# EAGLE design 24V_PWS (EAGLE 9.6.2)
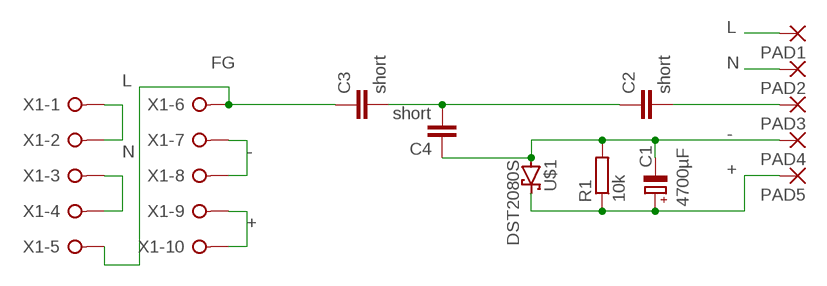
[diagram p0: schematic, sheet 1]

## Parts
C1  4700µF  CPOL-EUE7.5-18  [E7,5-18]
C2  short  C-EUC1206  [C1206]
C3  short  C-EUC1206  [C1206]
C4  short  C-EUC1206  [C1206]
PAD1  SMD5  [SMD2,54-5,08]
PAD2  SMD5  [SMD2,54-5,08]
PAD3  SMD5  [SMD2,54-5,08]
PAD4  SMD5  [SMD2,54-5,08]
PAD5  SMD5  [SMD2,54-5,08]
R1  10k  R-EU_R2012  [R2012]
U$1  DST2080S  [TO-277B]
X1  W237-10P  [W237-10P]

## Nets
+: C1.+ PAD5.1(P) R1.1 U$1.P$1(C) X1.9 X1.10
-: C1.- C4.1 PAD4.1(P) R1.2 U$1.P$2(A) U$1.P$3(A) X1.7 X1.8
FG: C3.1 X1.5 X1.6
L: PAD1.1(P) X1.1 X1.2
N: PAD2.1(P) X1.3 X1.4
N$1: C2.2 PAD3.1(P)
N$2: C2.1 C3.2 C4.2

## Library data of the parts
C1 = rcl:CPOL-EU: POLARIZED CAPACITOR, European symbol; SPICEPREFIX: C
C2-C4 = rcl:C-EU: CAPACITOR, European symbol; SPICEPREFIX: C
PAD1-PAD5 = wirepad:SMD5: SMD PAD
R1 = rcl:R-EU_: RESISTOR, European symbol; SPICEPREFIX: R
U$1 = Orzada:DST2080S: Schottky Diode TO-277B
X1 = con-wago-508:W237-10P: WAGO SREW CLAMP; OC_FARNELL: unknown; OC_NEWARK: unknown

## Board
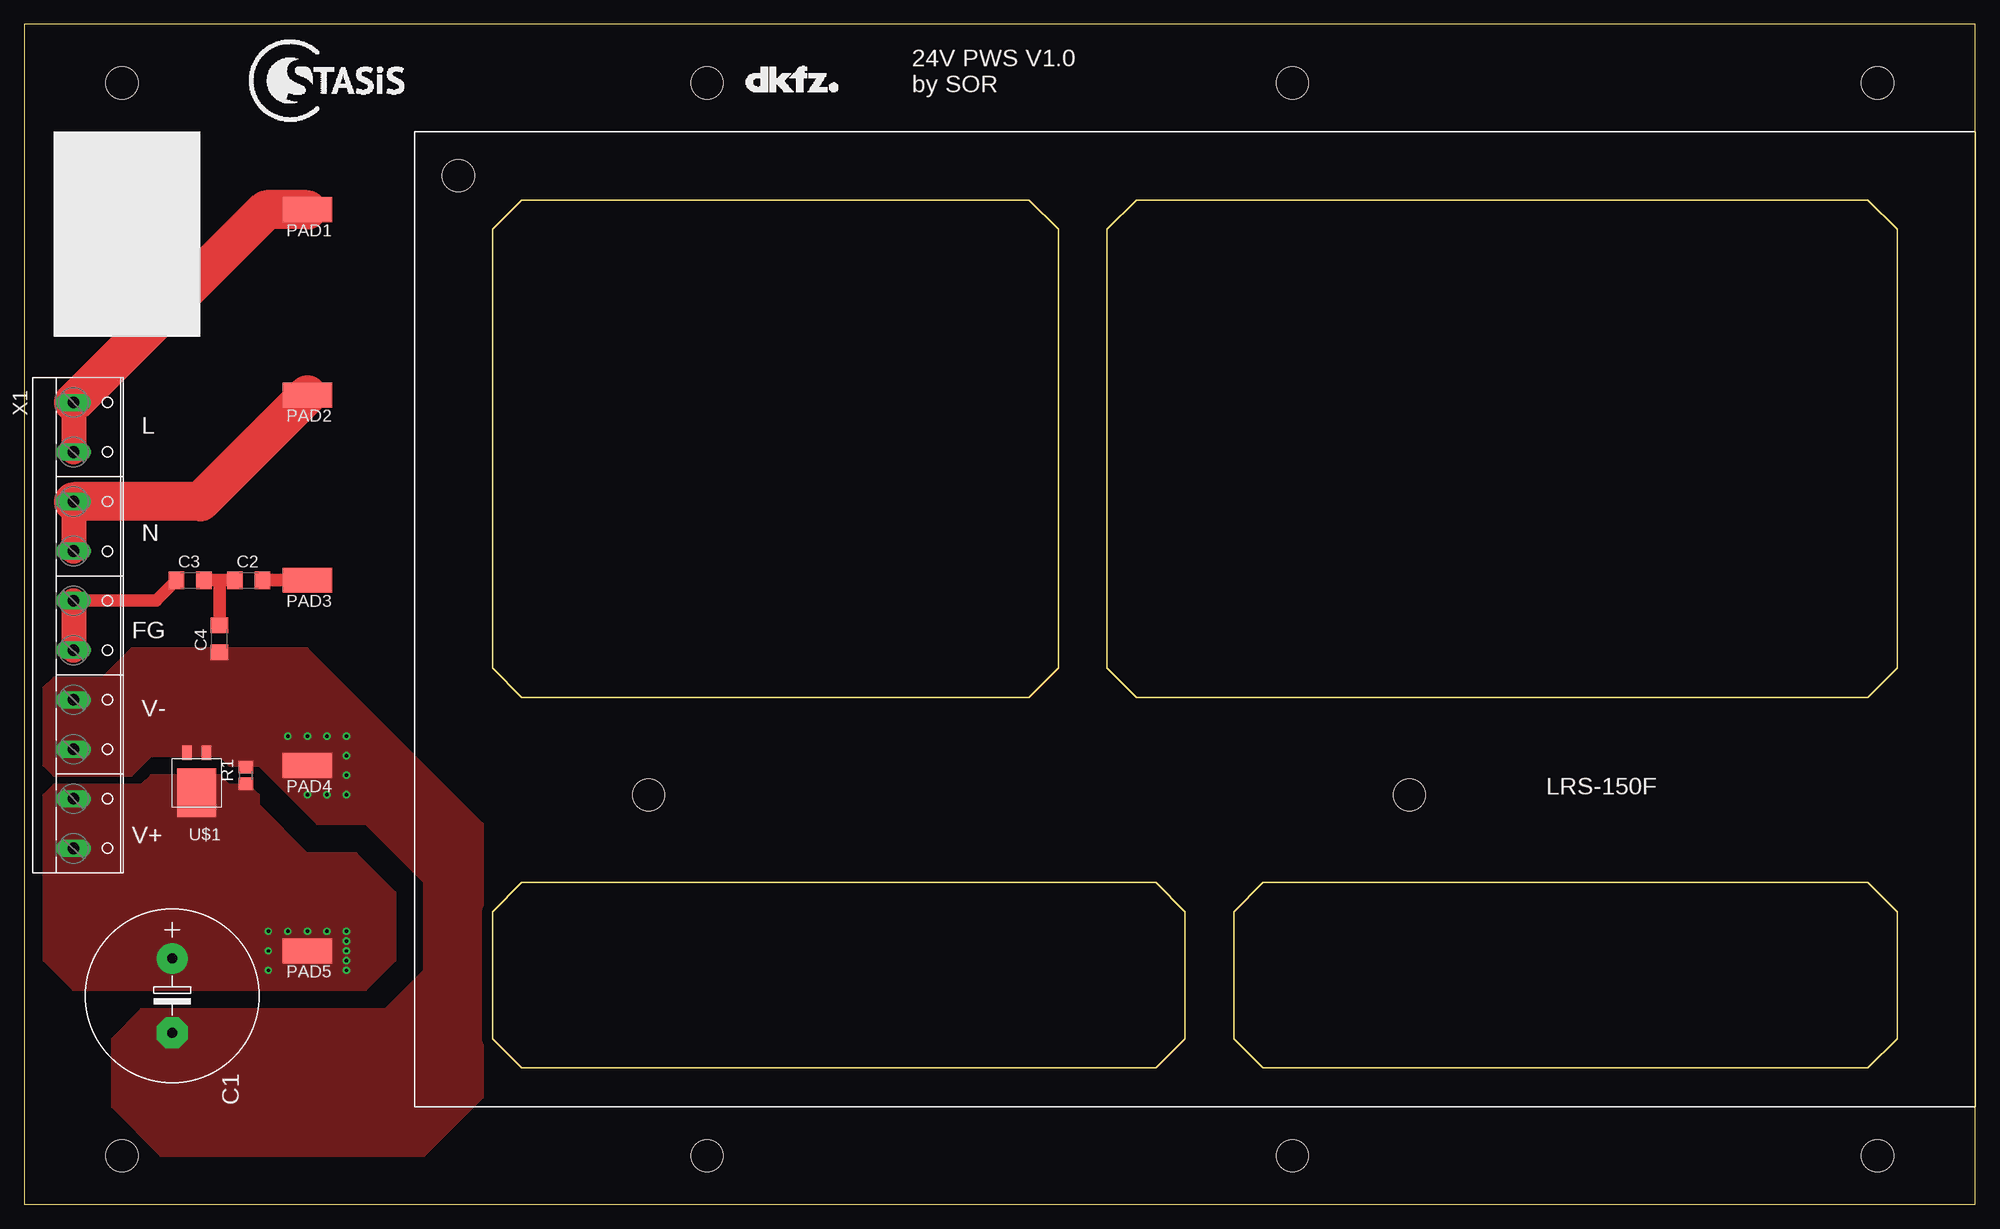
[diagram p1: board, top side]
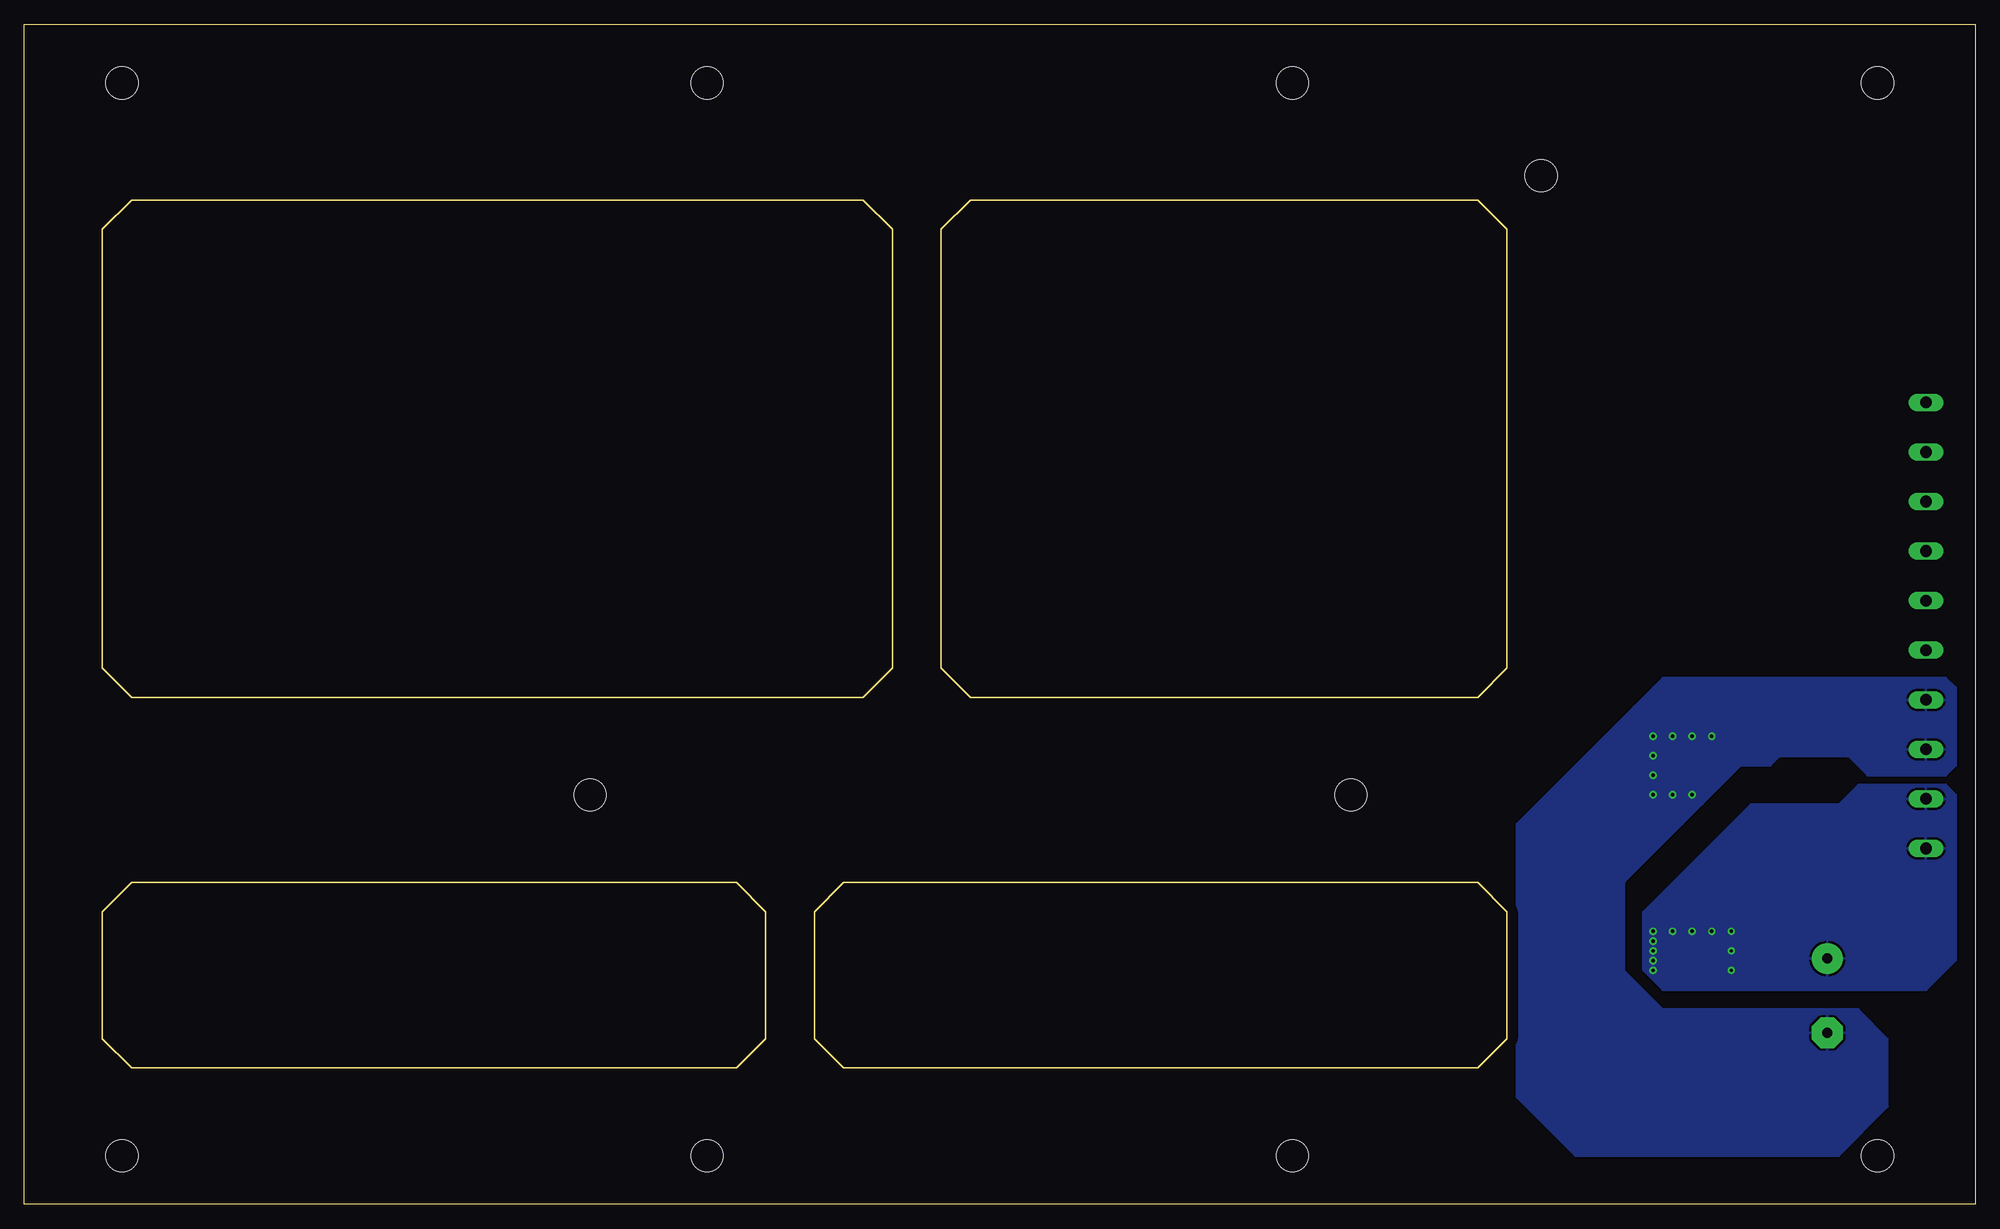
[diagram p2: board, bottom side, seen from below]

Size 200 x 121 mm. Coordinates in mm from the lower left corner, seen from the top.
Outline: 0,0 200,0 200,121 0,121 0,0
Outline: 48,55 51,52 103,52 106,55 106,100 103,103 51,103 48,100 48,55
Outline: 51,33 48,30 48,17 51,14 116,14 119,17 119,30 116,33 51,33
Outline: 111,100 114,103 189,103 192,100 192,55 189,52 114,52 111,55 111,100
Outline: 124,30 127,33 189,33 192,30 192,17 189,14 127,14 124,17 124,30
Copper layers (1*16): Top 0.035mm / dielectric 1.5mm / Bottom 0.035mm
Design rules "default": minimum track width 6mil, minimum drill 0.35mm, track to track 6mil, track to pad 6mil, pad to pad 6mil, via to via 6mil, smd to smd 6mil, copper to edge 40mil, drill to drill 6mil, minimum pad ring 10mil, minimum via ring 8mil, stop-mask expansion 4mil, vias tented up to drill 0mil, thermal gap 10mil
Holes 3.3 mm at 64,42 142,42 10,5 190,5 190,115 10,115 70,5 70,115 130,115 130,5 44.5,105.5

### Footprints (pad centres in the part's own frame; a part is rotated, then mirrored left to right if it is on the bottom)
E7,5-18 = drill 1.016 pad 3.15: + -3.81,0 | drill 1.016 pad 3.15 octagon: - 3.81,0
C1206 = smd 1.6 x 1.8: 1 -1.4,0; 2 1.4,0
SMD2,54-5,08 = smd 2.54 x 5.08: 1 0,0
R2012 = smd 1.3 x 1.5: 1 -0.85,0; 2 0.85,0
TO-277B = smd 4 x 5: P$1 0,2.5 | smd 1 x 1.5: P$2 -1,-1.6; P$3 1,-1.6
W237-10P = drill 1.194 long: 1 -22.86,-0.635; 2 -17.78,-0.635; 3 -12.7,-0.635; 4 -7.62,-0.635; 5 -2.54,-0.635; 6 2.54,-0.635; 7 7.62,-0.635; 8 12.7,-0.635; 9 17.78,-0.635; 10 22.86,-0.635

### Placement (x,y rotation side)
C1  15.16,21.4 270 top
C2  23,64 0 top
C3  17,64 0 top
C4  20,58 90 top
PAD1  29,102 90 top
PAD2  29,83 90 top
PAD3  29,64 90 top
PAD4  29,45 90 top
PAD5  29,26 90 top
R1  22.71,43.98 90 top
U$1  17.67,44.71 180 top
U$2  [LOGO_STASIS]  32,115 0 top
U$3  [LOGO_DKFZ]  74,114 0 top
X1  5.67,59.37 270 top

### Tracks (layer width: path | path; a pad name or v marks a point on that pad's centre or on a via)
+  (via drill 0.35)
  other vias: 33,27 33,26 33,25 33,24 33,28 31,28 29,28 27,28 25,28 25,26 25,24
  pour Top (no thermals): 3,43 2,42 2,25 5,22 35,22 38,25 38,32 34,36 29,36 24,41 24,42 23,43 21,43 20,44 14,44 13,44 12,43
  pour Bottom: 32,22 34,24 34,30 23,41 14,41 12,43 3,43 2,42 2,25 5,22
-  (via drill 0.35)
  other vias: 27,48 29,48 31,48 33,48 33,46 33,44 33,42 31,42 29,42
  pour Top (no thermals): 2,53 2,45 3,44 11,44 13,46 20,46 21,45 24,45 30,39 35,39 41,33 41,24 37,20 12,20 9,17 9,10 14,5 41,5 47,11 47,39 29,57 11,57 8,54 3,54
  pour Bottom: 28,41 30,39 33,39 34,40 35,41 35,51 33,53 32,54 4,54 3,54 2,53 2,45 3,44 11,44 13,46 20,46 21,45 24,45
  pour Bottom: 30,39 36,33 36,24 32,20 12,20 9,17 9,10 14,5 41,5 47,11 47,39 35,51 30,46
FG
  Top 1.27: C3.1 13.51,61.91 X1.5
  Top 2.54: X1.5 X1.6
L
  Top 2.54: X1.1 X1.2
  Top 4: PAD1.1 24.8,102 X1.1
N
  Top 2.54: X1.3 X1.4
  Top 4: PAD2.1 18.07,72.07 X1.3
N$1
  Top 1.27: PAD3.1 C2.2
N$2
  Top 1.27: C2.1 20,64 | 20,64 C3.2 | 20,64 C4.2

### Text on the board
tPlace: 24V PWS V1.0 / by SOR | L | N | FG | V- | LRS-150F | V+